# EAGLE design schematic (EAGLE 5.10)
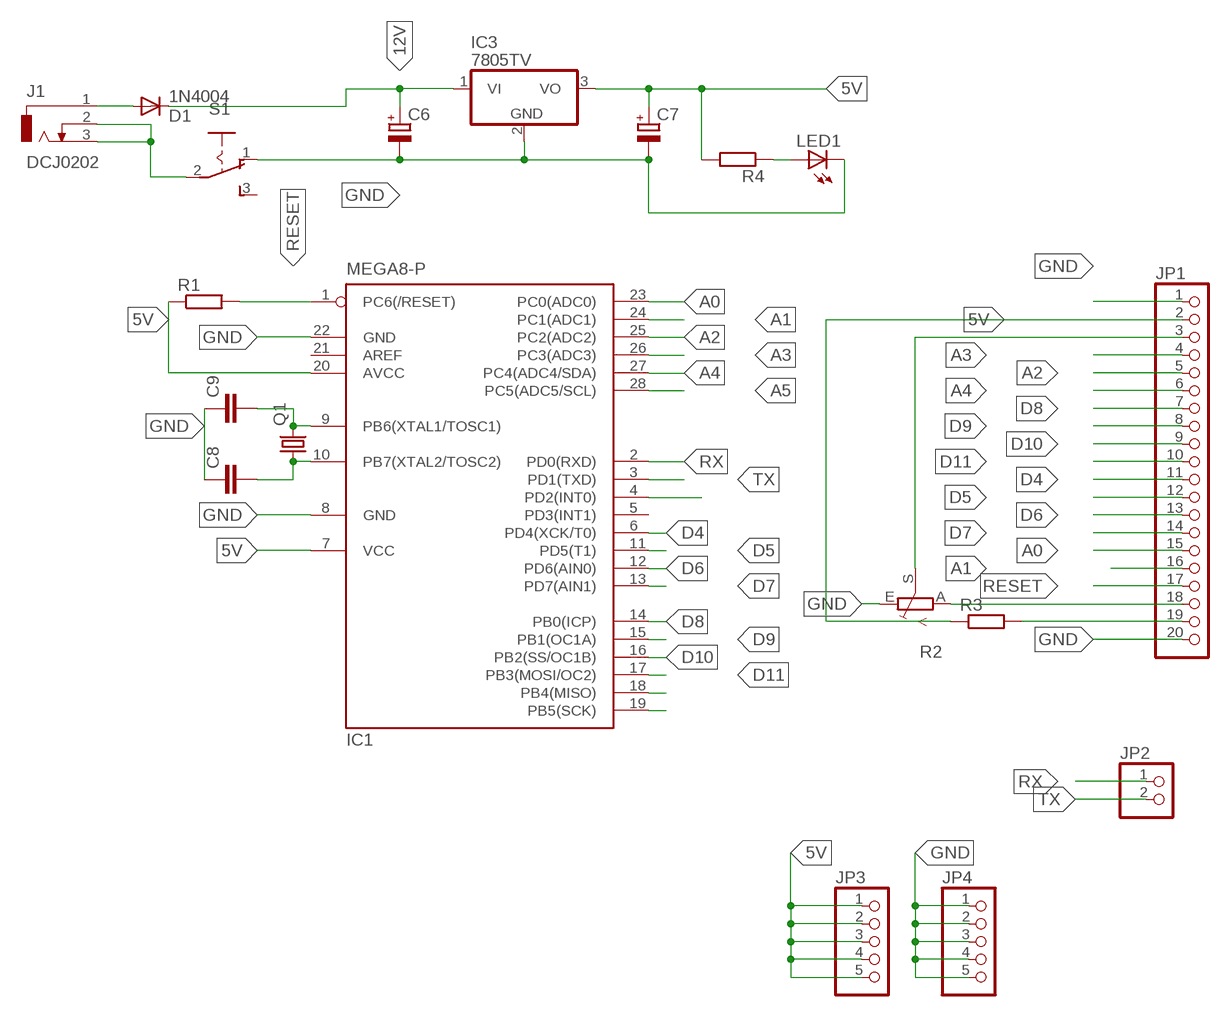
[diagram p0: schematic, sheet 1]

## Parts
C6  CPOL-EUE5-6  [E5-6]
C7  CPOL-EUE5-6  [E5-6]
C8  C-EU025-024X044  [C025-024X044]
C9  C-EU025-024X044  [C025-024X044]
D1  1N4004  [DO41-10]
IC1  MEGA8-P  [DIL28-3]
IC3  7805TV  [TO220V]
J1  DCJ0202  [DCJ0202]
JP1  PINHD-1X20  [1X20]
JP2  PINHD-1X2  [1X02]
JP3  PINHD-1X5  [1X05]
JP4  PINHD-1X5  [1X05]
LED1  LED3MM  [LED3MM]
Q1  CRYSTALHC49S  [HC49/S]
R1  R-EU_0207/10  [0207/10]
R2  TRIM_EU-B64Y  [B64Y]
R3  R-EU_0207/10  [0207/10]
R4  R-EU_0207/10  [0207/10]
S1  255SB  [255SB]

## Nets
5V: C7.+ IC1.7(VCC) IC1.20(AVCC) IC3.3(VO) JP1.2 JP3.1 JP3.2 JP3.3 JP3.4 JP3.5 R1.1 R3.1 R4.2
12V: C6.+ D1.C IC3.1(VI)
A0: IC1.23(PC0(ADC0)) JP1.15
A1: IC1.24(PC1(ADC1)) JP1.16
A2: IC1.25(PC2(ADC2)) JP1.5
A3: IC1.26(PC3(ADC3)) JP1.4
A4: IC1.27(PC4(ADC4/SDA)) JP1.6
A5: IC1.28(PC5(ADC5/SCL))
D4: IC1.6(PD4(XCK/T0)) JP1.11
D5: IC1.11(PD5(T1)) JP1.12
D6: IC1.12(PD6(AIN0)) JP1.13
D7: IC1.13(PD7(AIN1)) JP1.14
D8: IC1.14(PB0(ICP)) JP1.7
D9: IC1.15(PB1(OC1A)) JP1.8
D10: IC1.16(PB2(SS/OC1B)) JP1.9
D11: IC1.17(PB3(MOSI/OC2)) JP1.10
GND: C6.- C7.- C8.1 C9.1 IC1.8(GND) IC1.22(GND) IC3.2(GND) JP1.1 JP1.20 JP4.1 JP4.2 JP4.3 JP4.4 JP4.5 LED1.K(C) R2.E S1.1(O)
N$1: C9.2 IC1.9(PB6(XTAL1/TOSC1)) Q1.2
N$2: C8.2 IC1.10(PB7(XTAL2/TOSC2)) Q1.1
N$11: D1.A J1.1
N$12: IC1.4(PD2(INT0))
N$13: LED1.A R4.1
N$15: J1.2 J1.3 S1.2(P)
N$21: JP1.18 R2.A
N$22: JP1.19 R3.2
N$24: IC1.18(PB4(MISO))
N$25: IC1.19(PB5(SCK))
POTOUT: JP1.3 R2.S
RESET: IC1.1(PC6(/RESET)) JP1.17 R1.2
RX: IC1.2(PD0(RXD)) JP2.1
TX: IC1.3(PD1(TXD)) JP2.2
Unconnected: IC1.5(PD3(INT1)) IC1.21(AREF) S1.3(S)

## Library data of the parts
C6 C7 = rcl:CPOL-EU: POLARIZED CAPACITOR, European symbol
C8 C9 = rcl:C-EU: CAPACITOR, European symbol
D1 = diode:1N4004: DIODE general purpose rectifier, 1 A
IC1 = atmel:MEGA8-P: MICROCONTROLLER 8 Kbytes FLASH, 1 kbytes SRAM, 512 bytes EEPROM, USART, 4-channel 10 bit ADC, 2-channel 8 bit ADC Pin compatible with Atmega48, ATMega88, ATMega168 Source: avr.lbr
IC3 = linear:78*: Positive VOLTAGE REGULATOR Source: http://cache.national.com/ds/LM/LM78L05.pdf http://www.fairchildsemi.com/ds/LM/LM7805.pdf
J1 = con-jack:DCJ0202: DC POWER JACK Source: DCJ0202.pdf
JP1 = pinhead:PINHD-1X20: PIN HEADER
JP2 = pinhead:PINHD-1X2: PIN HEADER
JP3 JP4 = pinhead:PINHD-1X5: PIN HEADER
LED1 = led:LED: LED OSRAM: - CHIPLED LG R971, LG N971, LY N971, LG Q971, LY Q971, LO R971, LY R971 LH N974, LH R974 LS Q976, LO Q976, LY Q976 LO Q996 - Hyper CHIPLED LW Q18S LB Q993, LB Q99A, LB R99A - SideLED LS A670, LO A670, LY A670, LG A670, LP A670 LB A673, LV A673, LT A673, LW A673 LH A674 LY A675 LS A676, LA A676, LO A676, LY A676, LW A676 LS A679, LY A679, LG A679 - Hyper Micro SIDELED® LS Y876, LA Y876, LO Y876, LY Y876 LT Y87S - SmartLED LW L88C, LW L88S LB L89C, LB L89S, LG L890 LS L89K, LO L89K, LY L89K LS L896, LA L896, LO L896, LY L896 - TOPLED LS T670, LO T670, LY T670, LG T670, LP T670 LSG T670, LSP T670, LSY T670, LOP T670, LYG T670 LG T671, LOG T671, LSG T671 LB T673, LV T673, LT T673, LW T673 LH T674 LS T676, LA T676, LO T676, LY T676, LB T676, LH T676, LSB T676, LW T676 LB T67C, LV T67C, LT T67C, LS T67K, LO T67K, LY T67K, LW E67C LS E67B, LA E67B, LO E67B, LY E67B, LB E67C, LV E67C, LT E67C LW T67C LS T679, LY T679, LG T679 LS T770, LO T770, LY T770, LG T770, LP T770 LB T773, LV T773, LT T773, LW T773 LH T774 LS E675, LA E675, LY E675, LS T675 LS T776, LA T776, LO T776, LY T776, LB T776 LHGB T686 LT T68C, LB T68C - Hyper Mini TOPLED® LB M676 - Mini TOPLED Santana® LG M470 LS M47K, LO M47K, LY M47K Source: http://www.osram.convergy.de LUXEON: - LUMILED® LXK2-PW12-R00, LXK2-PW12-S00, LXK2-PW14-U00, LXK2-PW14-V00 LXK2-PM12-R00, LXK2-PM12-S00, LXK2-PM14-U00 LXK2-PE12-Q00, LXK2-PE12-R00, LXK2-PE12-S00, LXK2-PE14-T00, LXK2-PE14-U00 LXK2-PB12-K00, LXK2-PB12-L00, LXK2-PB12-M00, LXK2-PB14-N00, LXK2-PB14-P00, LXK2-PB14-Q00 LXK2-PR12-L00, LXK2-PR12-M00, LXK2-PR14-Q00, LXK2-PR14-R00 LXK2-PD12-Q00, LXK2-PD12-R00, LXK2-PD12-S00 LXK2-PH12-R00, LXK2-PH12-S00 LXK2-PL12-P00, LXK2-PL12-Q00, LXK2-PL12-R00 Source: www.luxeon.com KINGBRIGHT: KA-3528ASYC Source: www.kingbright.com
Q1 = crystal:CRYSTAL: CRYSTAL
R1 R3 R4 = rcl:R-EU_: RESISTOR, European symbol
R2 = pot:TRIM_EU-: POTENTIOMETER
S1 = switch:255SB: SLIDING SWITCH Distributor Buerklin, 11G810

## Board
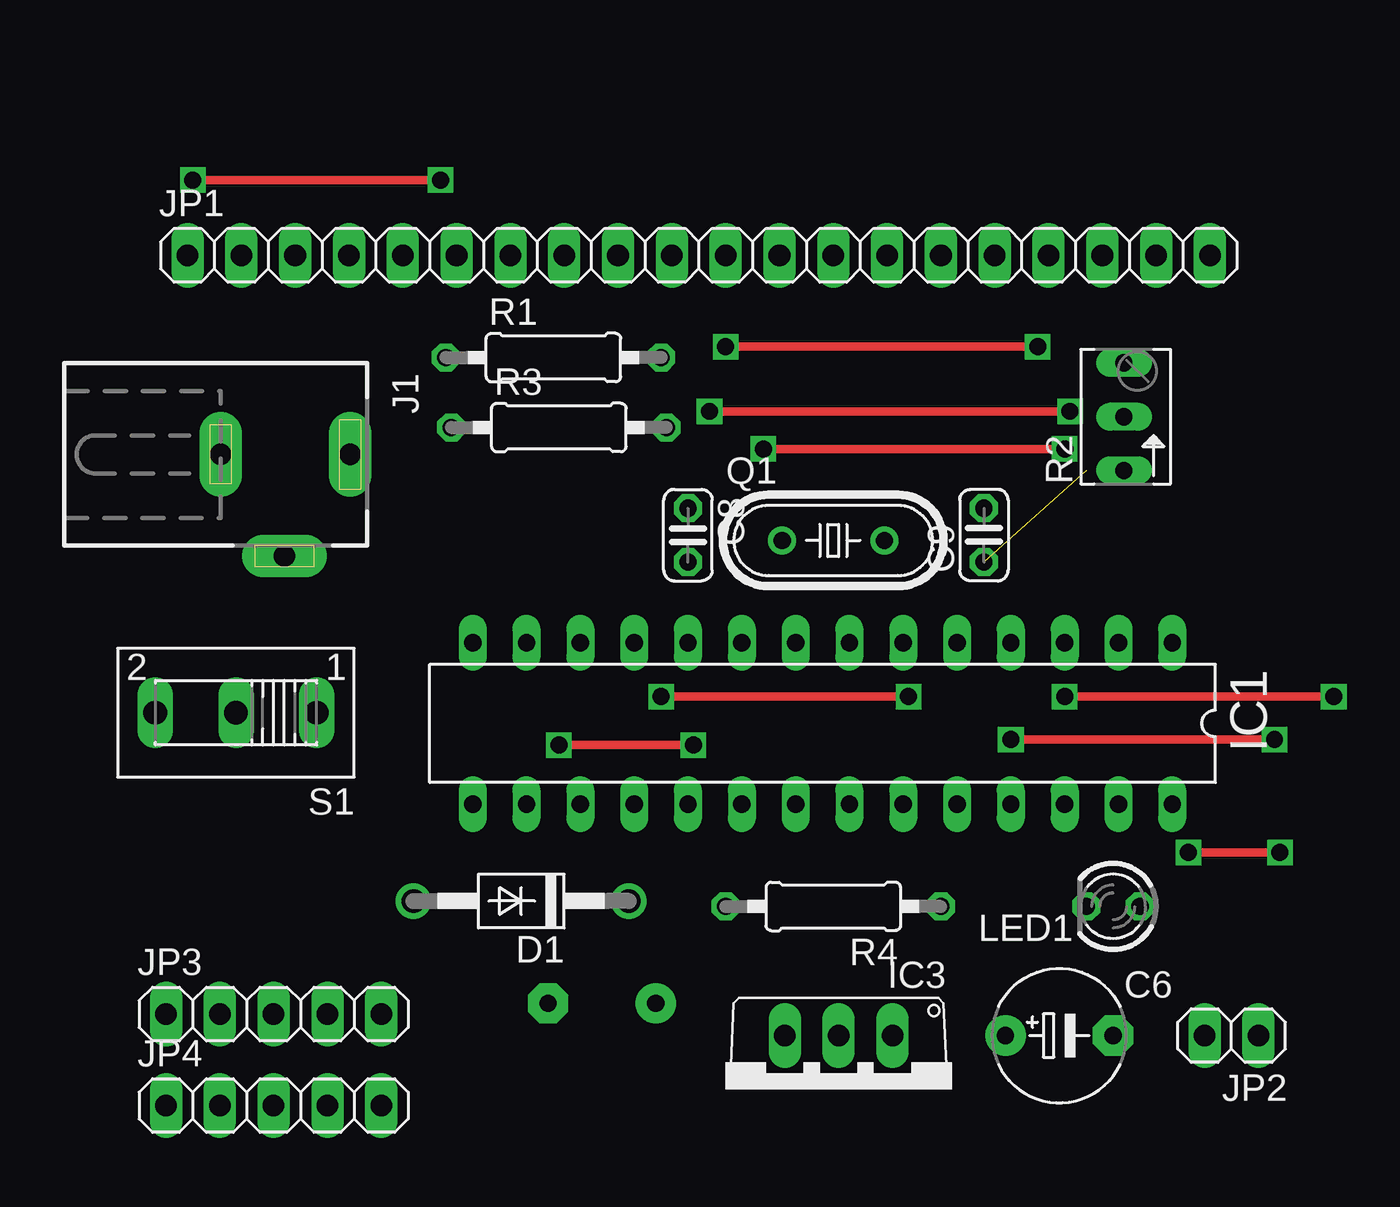
[diagram p1: board, top side]
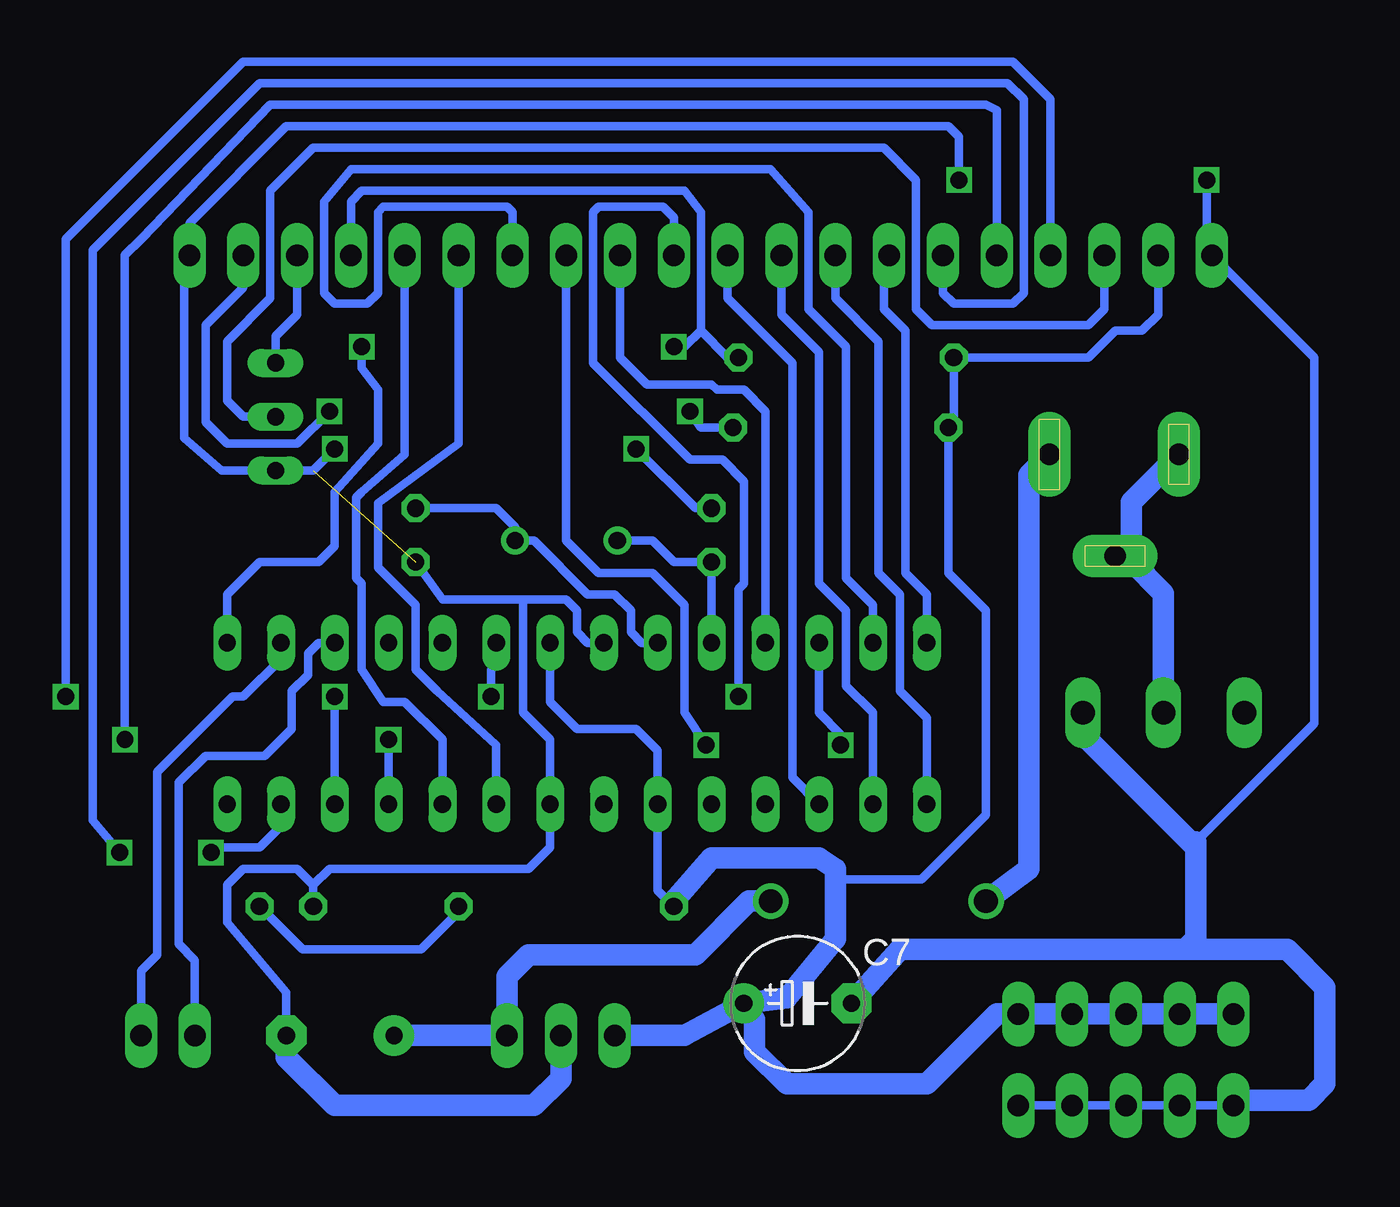
[diagram p2: board, bottom side, seen from below]

No outline drawn. Coordinates in mm, seen from the top.
Copper layers (1*16): Top 0.035mm / dielectric 1.5mm / Bottom 0.035mm
Design rules "default": minimum track width 10mil, minimum drill 24mil, track to track 8mil, track to pad 8mil, pad to pad 8mil, via to via 8mil, smd to smd 8mil, copper to edge 40mil, drill to drill 8mil, minimum pad ring 10mil, minimum via ring 8mil, stop-mask expansion 4mil, vias tented up to drill 0mil, thermal gap 10mil

### Footprints (pad centres in the part's own frame; a part is rotated, then mirrored left to right if it is on the bottom)
E5-6 = drill 0.813 pad 1.905 round: + -2.54,0 | drill 0.813 pad 1.905 octagon: - 2.54,0
C025-024X044 = drill 0.813 octagon: 1 -1.27,0; 2 1.27,0
DO41-10 = drill 1.118 round: A 5.08,0; C -5.08,0
DIL28-3 = drill 0.813 long: 1 -16.51,-3.81; 2 -13.97,-3.81; 3 -11.43,-3.81; 4 -8.89,-3.81; 5 -6.35,-3.81; 6 -3.81,-3.81; 7 -1.27,-3.81; 8 1.27,-3.81; 9 3.81,-3.81; 10 6.35,-3.81; 11 8.89,-3.81; 12 11.43,-3.81; 13 13.97,-3.81; 14 16.51,-3.81; 15 16.51,3.81; 16 13.97,3.81; 17 11.43,3.81; 18 8.89,3.81; 19 6.35,3.81; 20 3.81,3.81; 21 1.27,3.81; 22 -1.27,3.81; 23 -3.81,3.81; 24 -6.35,3.81; 25 -8.89,3.81; 26 -11.43,3.81; 27 -13.97,3.81; 28 -16.51,3.81
TO220V = drill 1.016 long: 1 -2.54,-2.54; 2 0,-2.54; 3 2.54,-2.54
DCJ0202 = drill 1 pad 2 long: 1 0,3.1; 2 4.8,0; 3 0,-3
1X20 = drill 1.016 long: 1 -24.13,0; 2 -21.59,0; 3 -19.05,0; 4 -16.51,0; 5 -13.97,0; 6 -11.43,0; 7 -8.89,0; 8 -6.35,0; 9 -3.81,0; 10 -1.27,0; 11 1.27,0; 12 3.81,0; 13 6.35,0; 14 8.89,0; 15 11.43,0; 16 13.97,0; 17 16.51,0; 18 19.05,0; 19 21.59,0; 20 24.13,0
1X02 = drill 1.016 long: 1 -1.27,0; 2 1.27,0
1X05 = drill 1.016 long: 1 -5.08,0; 2 -2.54,0; 3 0,0; 4 2.54,0; 5 5.08,0
LED3MM = drill 0.813 octagon: A -1.27,0; K 1.27,0
HC49/S = drill 0.813 round: 1 -2.413,0; 2 2.413,0
0207/10 = drill 0.813 octagon: 1 -5.08,0; 2 5.08,0
B64Y = drill 0.813 long: A 2.54,0; E -2.54,0; S 0,0
255SB = drill 1.118 long: 1 -3.81,0; 2 0,0; 3 3.81,0

### Placement (x,y rotation side)
C6  -113.79,37.85 0 top
C7  -135.38,39.37 0 bottom
C8  -131.32,61.47 270 top
C9  -117.35,61.47 90 top
D1  -139.19,44.2 180 top
IC1  -124.97,52.58 180 top
IC3  -124.21,35.31 180 top
J1  -150.37,65.28 270 top
JP1  -130.81,74.68 0 top
JP2  -105.66,37.85 180 top
JP3  -150.88,38.86 0 top
JP4  -150.88,34.54 0 top
LED1  -111.25,43.94 180 top
Q1  -124.46,61.21 0 top
R1  -137.67,69.85 0 top
R2  -110.74,67.06 90 top
R3  -137.41,66.55 0 top
R4  -124.46,43.94 180 top
S1  -152.65,53.09 180 top

### Tracks (layer width: path | path; a pad name or v marks a point on that pad's centre or on a via)
5V
  Bottom 0.406: IC1.7 -123.7,53.59 -124.97,52.32 -127.76,52.32 -128.78,51.31 IC1.20 -128.78,44.7 R4.2 | JP1.2 -152.4,71.88 -151.64,71.12 -150.37,71.12 -149.1,69.85 R1.1 -142.75,66.8 R3.1 -142.49,59.69 -144.27,57.91 -144.27,48.26 -141.22,45.21 -137.41,45.21 -137.16,44.96
  Bottom 1.016: IC3.3 -130.05,37.85 C7.+ | R4.2 -129.54,44.2 -131.32,46.23 -136.4,46.23 -137.16,45.72 -137.16,44.96 -137.16,42.42 -134.87,39.62 C7.+ | JP3.1 JP3.2 JP3.3 JP3.4 JP3.5 -144.78,38.86 -141.48,35.56 -134.87,35.56 -133.35,37.08 -133.35,38.61 -133.1,38.86 -133.1,39.12 C7.+
12V
  Bottom 1.016: C6.+ IC3.1 -121.67,40.64 -122.68,41.66 -130.56,41.66 -133.1,44.2 D1.C
A0
  Bottom 0.406: -119.38,75.18 JP1.15 -119.38,65.79 -115.57,62.99 -115.57,59.94 -117.35,58.17 -117.35,55.12 -118.36,54.1 -121.16,51.56 IC1.23
A1
  Bottom 0.406: IC1.24 -118.62,51.82 -116.84,53.59 -115.82,53.59 -114.81,55.12 -114.81,59.18 -114.55,59.44 -114.55,63.25 -114.81,63.5 -116.84,65.28 JP1.16
A2  (via drill 0.8)
  Top 0.406: v-103.63,51.82 v-116.08,51.82
  Bottom 0.406: v-116.08,51.82 IC1.25 | v-103.63,51.82 -103.63,74.68 -104.39,75.44 -110.49,81.79 -144.27,81.79 -144.78,81.53 JP1.5
A3  (via drill 0.8)
  Top 0.406: v-100.84,53.85 v-113.54,53.85
  Bottom 0.406: JP1.4 -147.32,82.04 -145.54,83.82 -109.22,83.82 -100.84,75.44 v-100.84,53.85 | v-113.54,53.85 IC1.26
A4  (via drill 0.8)
  Top 0.406: v-103.38,46.48 v-107.7,46.48
  Bottom 0.406: JP1.6 -142.24,72.9 -142.75,72.39 -145.54,72.39 -146.05,72.9 -146.05,82.04 -145.29,82.8 -109.98,82.8 -102.11,74.93 -102.11,48.01 v-103.38,46.48 | v-107.7,46.48 -107.95,46.74 -109.98,46.74 -111,47.75 IC1.27
D4  (via drill 0.8)
  Top 0.406: v-132.59,53.85 v-120.9,53.85
  Bottom 0.406: JP1.11 -129.54,76.45 -129.03,76.96 -125.98,76.96 -125.73,76.71 -125.73,69.6 -130.3,65.02 -131.83,65.02 -132.84,64.01 -132.84,59.18 -132.59,58.93 v-132.59,53.85 | v-120.9,53.85 -120.9,55.12 -121.16,55.37 IC1.6
D5
  Bottom 0.406: IC1.11 -133.86,67.31 -132.84,68.33 -131.57,68.33 -131.32,68.58 -128.27,68.58 -127,69.85 JP1.12
D6  (via drill 0.8)
  Top 0.406: v-131.06,51.56 v-137.41,51.56
  Bottom 0.406: JP1.13 -124.46,61.21 -125.98,59.69 -128.52,59.69 -130.05,58.17 -130.05,53.09 v-131.06,51.56 | v-137.41,51.56 -137.41,52.07 -136.4,53.09 IC1.12
D7
  Bottom 0.406: IC1.13 -138.94,58.17 -137.67,59.44 -137.67,70.36 -135.89,72.14 -135.89,76.71 -134.11,78.74 -114.3,78.74 -113.03,77.22 -113.03,72.9 -113.54,72.39 -115.06,72.39 -115.57,72.9 -115.57,76.71 -115.82,76.96 -121.67,76.96 -121.92,76.71 JP1.14
D8
  Bottom 0.406: IC1.14 -141.48,58.67 -140.46,59.69 -140.46,71.12 -139.45,72.14 -139.45,74.42 JP1.7
D9
  Bottom 0.406: IC1.15 -141.48,52.83 -140.21,54.1 -140.21,58.67 -139.19,59.69 -139.19,70.61 -137.16,72.64 JP1.8
D10
  Bottom 0.406: IC1.16 -138.94,53.09 -137.67,54.36 -137.67,57.91 -136.4,59.18 -136.4,70.1 -134.62,71.88 JP1.9
D11
  Bottom 0.406: JP1.10 -132.08,72.64 -135.13,69.6 -135.13,50.04 IC1.17
GND  (via drill 0.8)  (1 unrouted)
  Top 0.406: v-113.54,65.53 v-127.76,65.53 | v-143,78.23 v-154.69,78.23
  Bottom 0.406: -122.43,58.42 -118.62,58.42 C9.1 | C6.- -111.25,39.88 -108.46,43.18 -108.46,44.96 -109.22,45.72 -111.76,45.72 -112.52,44.96 | -112.52,44.96 LED1.K | -112.52,44.96 -113.28,45.72 -122.68,45.72 -123.7,46.74 IC1.22 -123.7,51.82 -122.43,53.09 -122.43,58.42 | -154.18,46.99 -159.77,52.58 -159.77,69.85 JP1.1 -154.69,74.93 v-154.69,78.23 | C8.1 -130.56,62.74 v-127.76,65.53 | v-113.54,65.53 -112.52,64.52 R2.E -108.2,64.52 -106.43,66.04 -106.43,74.17 JP1.20 -106.68,76.2 -111.25,80.77 -142.49,80.77 -143,80.26 v-143,78.23 | IC1.8 -125.48,56.39 -124.97,56.9 -124.97,57.91 -124.46,58.42 -122.43,58.42 | JP4.1 JP4.2 JP4.3 JP4.4 | JP4.4 -148.34,34.29 | JP4.4 JP4.5
  Bottom 1.016: S1.1 -148.84,52.07 -154.18,46.74 | -154.18,46.99 -154.18,46.74 | C7.- -140.21,41.91 -153.67,41.91 | IC3.2 -124.21,35.81 -122.94,34.54 -113.54,34.54 -111.25,36.83 C6.- | -153.67,41.91 -158.5,41.91 -160.27,40.13 -160.27,35.56 -159.51,34.8 -156.21,34.8 JP4.1 | -154.18,46.74 -154.18,42.42 -153.67,41.91
N$1
  Bottom 0.406: C9.2 -121.16,62.74 -122.05,61.85 Q1.2 -122.94,61.21 -125.48,58.67 -126.75,58.67 -127.51,57.91 -127.51,56.9 -128.02,56.39 IC1.9
N$2
  Bottom 0.406: Q1.1 -128.52,61.21 -129.54,60.2 C8.2 IC1.10
N$11
  Bottom 1.016: D1.A -146.3,45.72 -146.3,64.31 J1.1
N$13
  Bottom 0.406: R4.1 -119.38,43.69 -117.6,41.91 -112.01,41.91 LED1.A
N$15
  Bottom 1.016: S1.2 -152.65,58.72 -151.13,60.25 -151.13,63.04 J1.3
  Bottom 1.27: J1.2 -151.13,60.25
N$21
  Bottom 0.406: R2.A -110.74,70.87 -111.76,71.88 JP1.18
N$22  (via drill 0.8)
  Top 0.406: v-113.28,67.31 v-130.3,67.31
  Bottom 0.406: JP1.19 -109.22,73.15 -107.44,71.37 -107.44,66.8 -108.46,65.79 -111.76,65.79 v-113.28,67.31 | R3.2 -130.81,66.55 v-130.3,67.31
POTOUT
  Bottom 0.406: R2.S -109.22,67.06 -108.46,67.82 -108.46,70.61 -110.49,72.64 -110.49,77.72 -112.52,79.76 -139.45,79.76 -140.97,78.23 -140.97,72.14 -141.73,71.37 -149.1,71.37 -149.86,72.14 JP1.3
RESET  (via drill 0.8)
  Top 0.406: v-129.54,70.36 v-114.81,70.36
  Bottom 0.406: R1.2 -132.08,69.85 -130.81,71.12 | -130.81,71.12 -130.81,76.71 -130.05,77.72 -114.81,77.72 -114.3,77.22 JP1.17 | IC1.1 -108.46,58.67 -109.98,60.2 -112.78,60.2 -113.54,60.96 -113.54,63.5 -115.57,65.79 -115.57,68.33 -114.81,69.34 v-114.81,70.36 | v-129.54,70.36 -130.05,70.36 -130.81,71.12
RX
  Bottom 0.406: JP2.1 -104.39,40.89 -105.16,41.66 -105.16,50.29 -108.71,53.85 -109.22,53.85 -111,55.63 IC1.2
TX
  Bottom 0.406: IC1.3 -112.78,56.39 -112.27,55.88 -112.27,54.86 -111.51,54.1 -111.51,52.32 -110.24,51.05 -107.44,51.05 -106.17,49.78 -106.17,42.16 -106.93,41.4 JP2.2